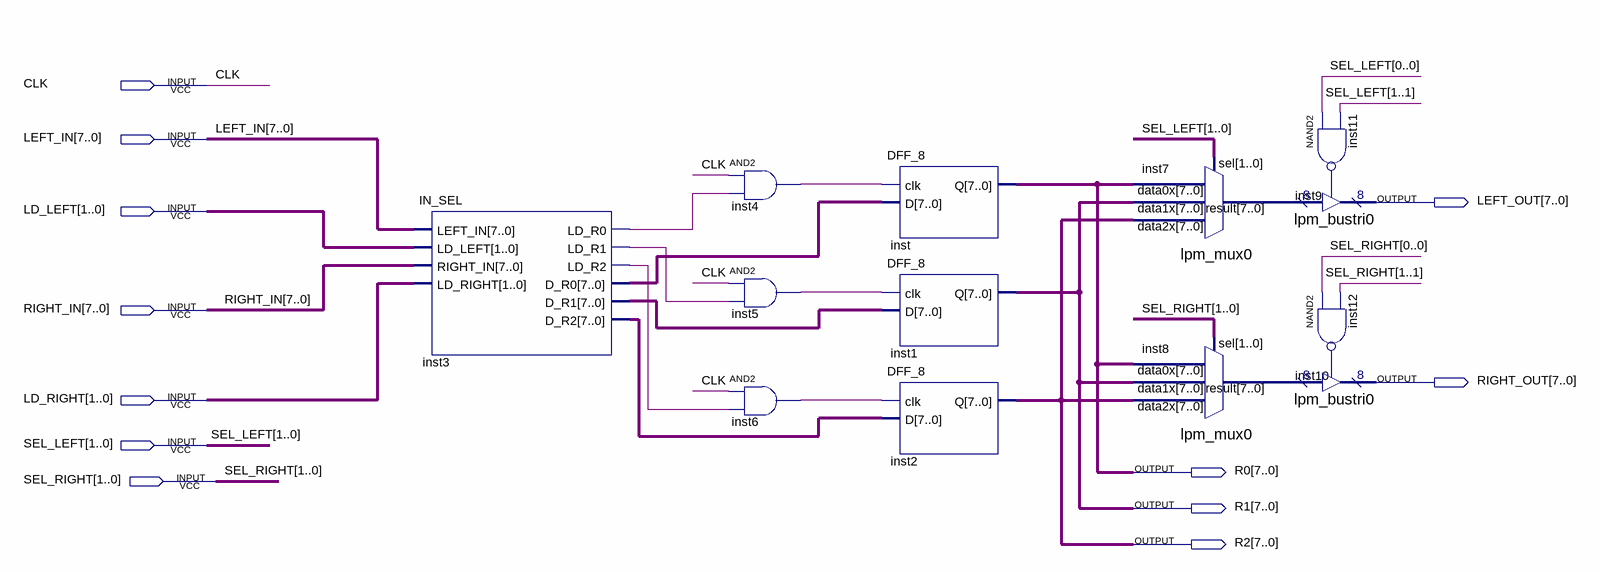
[diagram p0: schematic sheet]
// Quartus schematic REG1.bdf as structural Verilog: 13 symbols, 12 pins
module REG1 (
  input  CLK,
  input  [7:0] LEFT_IN,
  input  [1:0] LD_LEFT,
  input  [7:0] RIGHT_IN,
  input  [1:0] LD_RIGHT,
  input  [1:0] SEL_LEFT,
  input  [1:0] SEL_RIGHT,
  output [7:0] LEFT_OUT,
  output [7:0] RIGHT_OUT,
  output [7:0] R0,
  output [7:0] R1,
  output [7:0] R2
);

  wire inst3_ld_r0, inst3_ld_r1, inst3_ld_r2, inst4_out, inst5_out, inst6_out, inst11_out, inst12_out;
  wire [7:0] inst3_d_r0, inst3_d_r1, inst3_d_r2, inst7_result, inst8_result;

  IN_SEL inst3 (
    .LEFT_IN(LEFT_IN), .LD_LEFT(LD_LEFT), .RIGHT_IN(RIGHT_IN), .LD_RIGHT(LD_RIGHT), .LD_R0(inst3_ld_r0),
    .LD_R1(inst3_ld_r1), .LD_R2(inst3_ld_r2), .D_R0(inst3_d_r0), .D_R1(inst3_d_r1), .D_R2(inst3_d_r2));
  and inst4 (inst4_out, CLK, inst3_ld_r0);
  and inst5 (inst5_out, CLK, inst3_ld_r1);
  and inst6 (inst6_out, CLK, inst3_ld_r2);
  DFF_8 inst (.clk(inst4_out), .D(inst3_d_r0), .Q(R0));
  DFF_8 inst1 (.clk(inst5_out), .D(inst3_d_r1), .Q(R1));
  DFF_8 inst2 (.clk(inst6_out), .D(inst3_d_r2), .Q(R2));
  lpm_mux0 inst7 (.data2x(R2), .data1x(R1), .data0x(R0), .sel(SEL_LEFT), .result(inst7_result));
  lpm_mux0 inst8 (.data2x(R2), .data1x(R1), .data0x(R0), .sel(SEL_RIGHT), .result(inst8_result));
  lpm_bustri0 inst9 (.enabledt(inst11_out), .data(inst7_result), .tridata(LEFT_OUT));
  lpm_bustri0 inst10 (.enabledt(inst12_out), .data(inst8_result), .tridata(RIGHT_OUT));
  nand inst11 (inst11_out, SEL_LEFT[0], SEL_LEFT[1]);
  nand inst12 (inst12_out, SEL_RIGHT[0], SEL_RIGHT[1]);
endmodule
